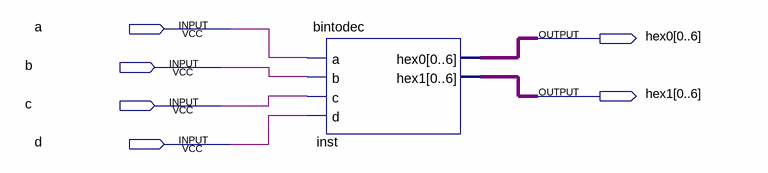
[diagram p0: schematic sheet]
// Quartus schematic Lab4B.bdf as structural Verilog: 1 symbols, 6 pins
module Lab4B (
  input  a,
  input  b,
  input  c,
  input  d,
  output [0:6] hex0,
  output [0:6] hex1
);

  bintodec inst (.a(a), .b(b), .c(c), .d(d), .hex0(hex0), .hex1(hex1));
endmodule
